# EAGLE design electrode_tester (EAGLE 9.1.3)
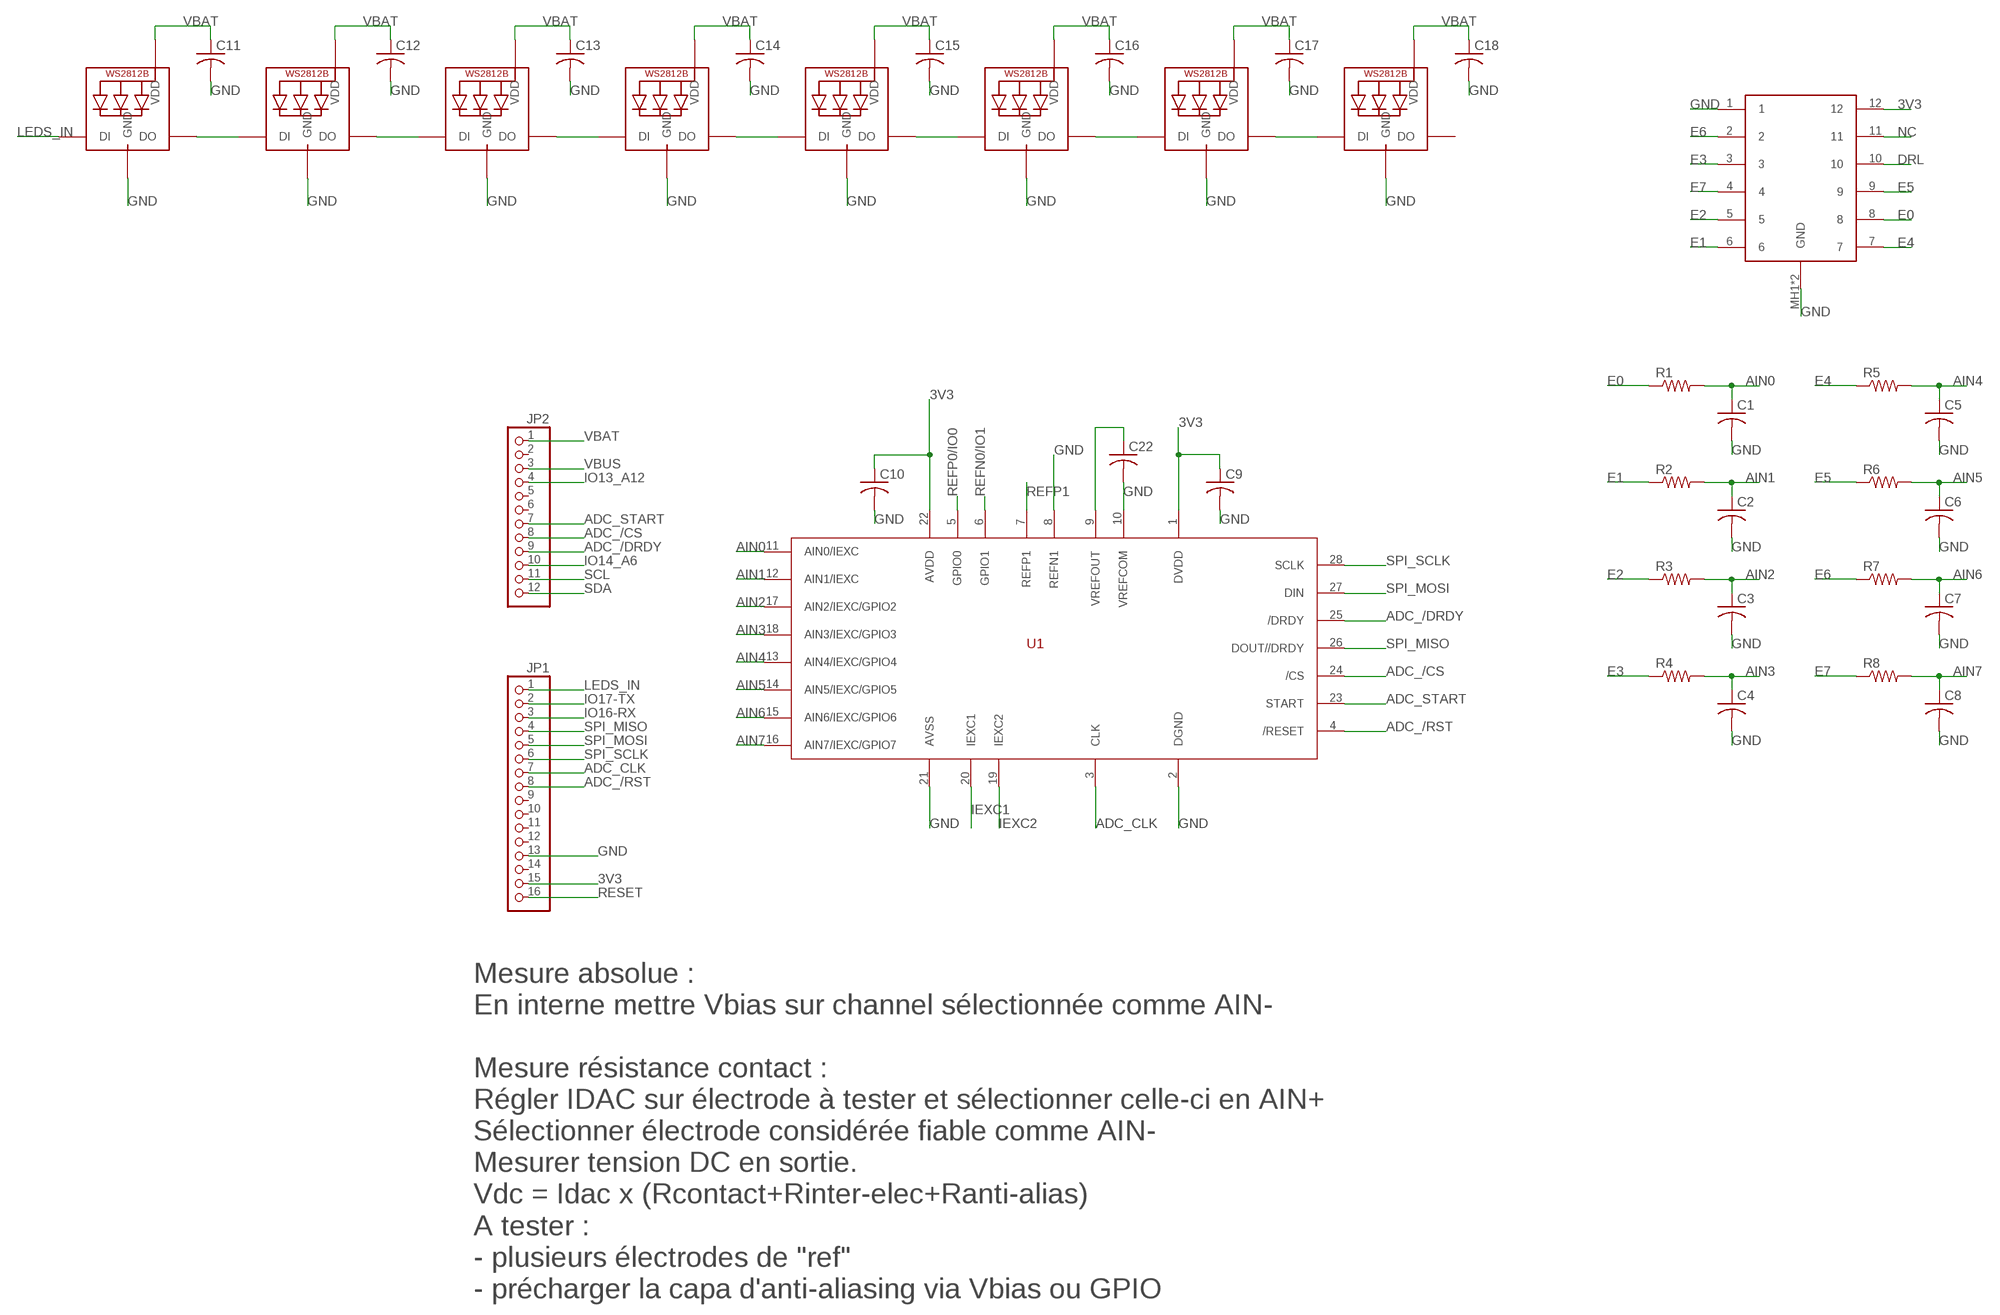
[diagram p0: schematic, sheet 1, part 1 of 2]
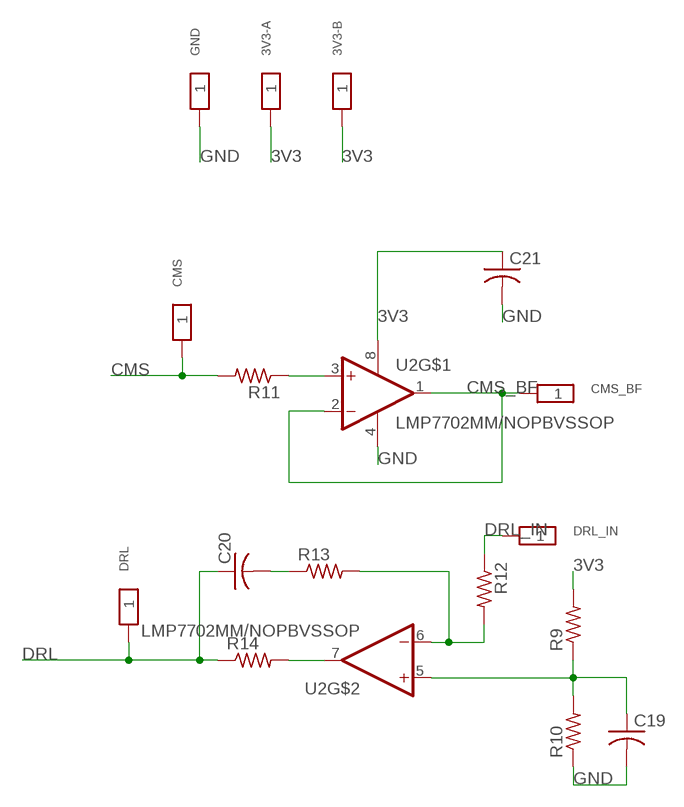
[diagram p1: schematic, sheet 1, part 2 of 2]

## Parts
3V3-A  TESTPAD_PROG  [TP1.5MM]
3V3-B  TESTPAD_PROG  [TP1.5MM]
C1  C-USC0603  [C0603]
C2  C-USC0603  [C0603]
C3  C-USC0603  [C0603]
C4  C-USC0603  [C0603]
C5  C-USC0603  [C0603]
C6  C-USC0603  [C0603]
C7  C-USC0603  [C0603]
C8  C-USC0603  [C0603]
C9  C-USC0603  [C0603]
C10  C-USC0603  [C0603]
C11  C-USC0603  [C0603]
C12  C-USC0603  [C0603]
C13  C-USC0603  [C0603]
C14  C-USC0603  [C0603]
C15  C-USC0603  [C0603]
C16  C-USC0603  [C0603]
C17  C-USC0603  [C0603]
C18  C-USC0603  [C0603]
C19  C-USC0603  [C0603]
C20  C-USC0603  [C0603]
C21  C-USC0603  [C0603]
C22  C-USC0603  [C0603]
CMS  TESTPAD_PROG  [TP1.5MM]
CMS_BF  TESTPAD_PROG  [TP1.5MM]
CONN1  505110-1292  [505110-1292]
DRL  TESTPAD_PROG  [TP1.5MM]
DRL_IN  TESTPAD_PROG  [TP1.5MM]
GND  TESTPAD_PROG  [TP1.5MM]
JP1  HEADER-1X16ROUND  [1X16_ROUND]
JP2  HEADER-1X12  [1X12_ROUND]
LED1  WS2812B5050  [WS2812B]
LED2  WS2812B5050  [WS2812B]
LED3  WS2812B5050  [WS2812B]
LED4  WS2812B5050  [WS2812B]
LED5  WS2812B5050  [WS2812B]
LED6  WS2812B5050  [WS2812B]
LED7  WS2812B5050  [WS2812B]
LED8  WS2812B5050  [WS2812B]
R1  R-US_R0603  [R0603]
R2  R-US_R0603  [R0603]
R3  R-US_R0603  [R0603]
R4  R-US_R0603  [R0603]
R5  R-US_R0603  [R0603]
R6  R-US_R0603  [R0603]
R7  R-US_R0603  [R0603]
R8  R-US_R0603  [R0603]
R9  R-US_R0603  [R0603]
R10  R-US_R0603  [R0603]
R11  R-US_R0603  [R0603]
R12  R-US_R0603  [R0603]
R13  R-US_R0603  [R0603]
R14  R-US_R0603  [R0603]
U1  ADS1248  [TSSOP28]
U2  LMP7702MM/NOPBVSSOP  [VSSOP8]

## Nets
3V3: 3V3-A.1 3V3-B.1 C9.1 C10.1 C21.1 CONN1.12 JP1.15 R9.2 U1.1(DVDD) U1.22(AVDD) U2.8(V+)
ADC_/CS: JP2.8 U1.24(/CS)
ADC_/DRDY: JP2.9 U1.25(/DRDY)
ADC_/RST: JP1.8 U1.4(/RESET)
ADC_CLK: JP1.7 U1.3(CLK)
ADC_START: JP2.7 U1.23(START)
AIN0: C1.1 R1.2 U1.11(AIN0/IEXC)
AIN1: C2.1 R2.2 U1.12(AIN1/IEXC)
AIN2: C3.1 R3.2 U1.17(AIN2/IEXC/GPIO2)
AIN3: C4.1 R4.2 U1.18(AIN3/IEXC/GPIO3)
AIN4: C5.1 R5.2 U1.13(AIN4/IEXC/GPIO4)
AIN5: C6.1 R6.2 U1.14(AIN5/IEXC/GPIO5)
AIN6: C7.1 R7.2 U1.15(AIN6/IEXC/GPIO6)
AIN7: C8.1 R8.2 U1.16(AIN7/IEXC/GPIO7)
CMS: CMS.1 R11.2
CMS_BF: CMS_BF.1 U2.1(OUT) U2.2(-IN)
DRL: C20.1 CONN1.10 DRL.1 R14.1
DRL_IN: DRL_IN.1 R12.1
E0: CONN1.8 R1.1
E1: CONN1.6 R2.1
E2: CONN1.5 R3.1
E3: CONN1.3 R4.1
E4: CONN1.7 R5.1
E5: CONN1.9 R6.1
E6: CONN1.2 R7.1
E7: CONN1.4 R8.1
GND: C1.2 C2.2 C3.2 C4.2 C5.2 C6.2 C7.2 C8.2 C9.2 C10.2 C11.2 C12.2 C13.2 C14.2 C15.2 C16.2 C17.2 C18.2 C19.2 C21.2 C22.2 CONN1.1 CONN1.MH1(GND) CONN1.MH2(GND) GND.1 JP1.13 LED1.3-GND(GND) LED2.3-GND(GND) LED3.3-GND(GND) LED4.3-GND(GND) LED5.3-GND(GND) LED6.3-GND(GND) LED7.3-GND(GND) LED8.3-GND(GND) R10.1 U1.2(DGND) U1.8(REFN1) U1.10(VREFCOM) U1.21(AVSS) U2.4(V-)
IEXC1: U1.20(IEXC1)
IEXC2: U1.19(IEXC2)
IO13_A12: JP2.4
IO14_A6: JP2.10
IO16-RX: JP1.3
IO17-TX: JP1.2
LEDS_IN: JP1.1 LED1.4-DIN(DI)
N$1: LED1.2-DOUT(DO) LED2.4-DIN(DI)
N$2: LED2.2-DOUT(DO) LED3.4-DIN(DI)
N$3: LED3.2-DOUT(DO) LED4.4-DIN(DI)
N$4: LED4.2-DOUT(DO) LED5.4-DIN(DI)
N$5: LED5.2-DOUT(DO) LED6.4-DIN(DI)
N$6: LED6.2-DOUT(DO) LED7.4-DIN(DI)
N$7: LED7.2-DOUT(DO) LED8.4-DIN(DI)
N$8: R11.1 U2.3(+IN)
N$9: C22.1 U1.9(VREFOUT)
N$12: R12.2 R13.2 U2.6(-IN)
N$14: C20.2 R13.1
N$15: R14.2 U2.7(OUT)
N$16: C19.1 R9.1 R10.2 U2.5(+IN)
NC: CONN1.11
REFN0/IO1: U1.6(GPIO1)
REFP0/IO0: U1.5(GPIO0)
REFP1: U1.7(REFP1)
RESET: JP1.16
SCL: JP2.11
SDA: JP2.12
SPI_MISO: JP1.4 U1.26(DOUT//DRDY)
SPI_MOSI: JP1.5 U1.27(DIN)
SPI_SCLK: JP1.6 U1.28(SCLK)
VBAT: C11.1 C12.1 C13.1 C14.1 C15.1 C16.1 C17.1 C18.1 JP2.1 LED1.1-VDD(VDD) LED2.1-VDD(VDD) LED3.1-VDD(VDD) LED4.1-VDD(VDD) LED5.1-VDD(VDD) LED6.1-VDD(VDD) LED7.1-VDD(VDD) LED8.1-VDD(VDD)
VBUS: JP2.3
Unconnected: JP1.9 JP1.10 JP1.11 JP1.12 JP1.14 JP2.2 JP2.5 JP2.6 LED8.2-DOUT(DO)

## Notes on the sheet
- Mesure absolue :
  En interne mettre Vbias sur channel sélectionnée comme AIN-
  
  Mesure résistance contact :
  Régler IDAC sur électrode à tester et sélectionner celle-ci en AIN+
  Sélectionner électrode considérée fiable comme AIN-
  Mesurer tension DC en sortie.
  Vdc = Idac x (Rcontact+Rinter-elec+Ranti-alias)
  A tester : 
  - plusieurs électrodes de "ref"
  - précharger la capa d'anti-aliasing via Vbias ou GPIO

## Library data of the parts
3V3-A 3V3-B CMS CMS_BF DRL DRL_IN GND = electrode_tester:TESTPAD_PROG: TESTPAD
C1-C22 = electrode_tester:C-US: CAPACITOR, American symbol; SPICEPREFIX: C
CONN1 = electrode_tester:505110-1292
JP1 = electrode_tester:HEADER-1X16: PIN HEADER
JP2 = electrode_tester:HEADER-1X12
LED1-LED8 = electrode_tester:WS2812B
R1-R14 = electrode_tester:R-US_: RESISTOR, American symbol; SPICEPREFIX: R
U1 = electrode_tester:ADS1248
U2 = electrode_tester:LMP7702MM/NOPB: Op Amps Prec RRIO 12V Dual Op Amp; DESCRIPTION: Op Amps Prec RRIO 12V Dual Op Amp; MF: Texas Instruments; MP: LMP7702MM/NOPB; PACKAGE: MSOP-8

## Board
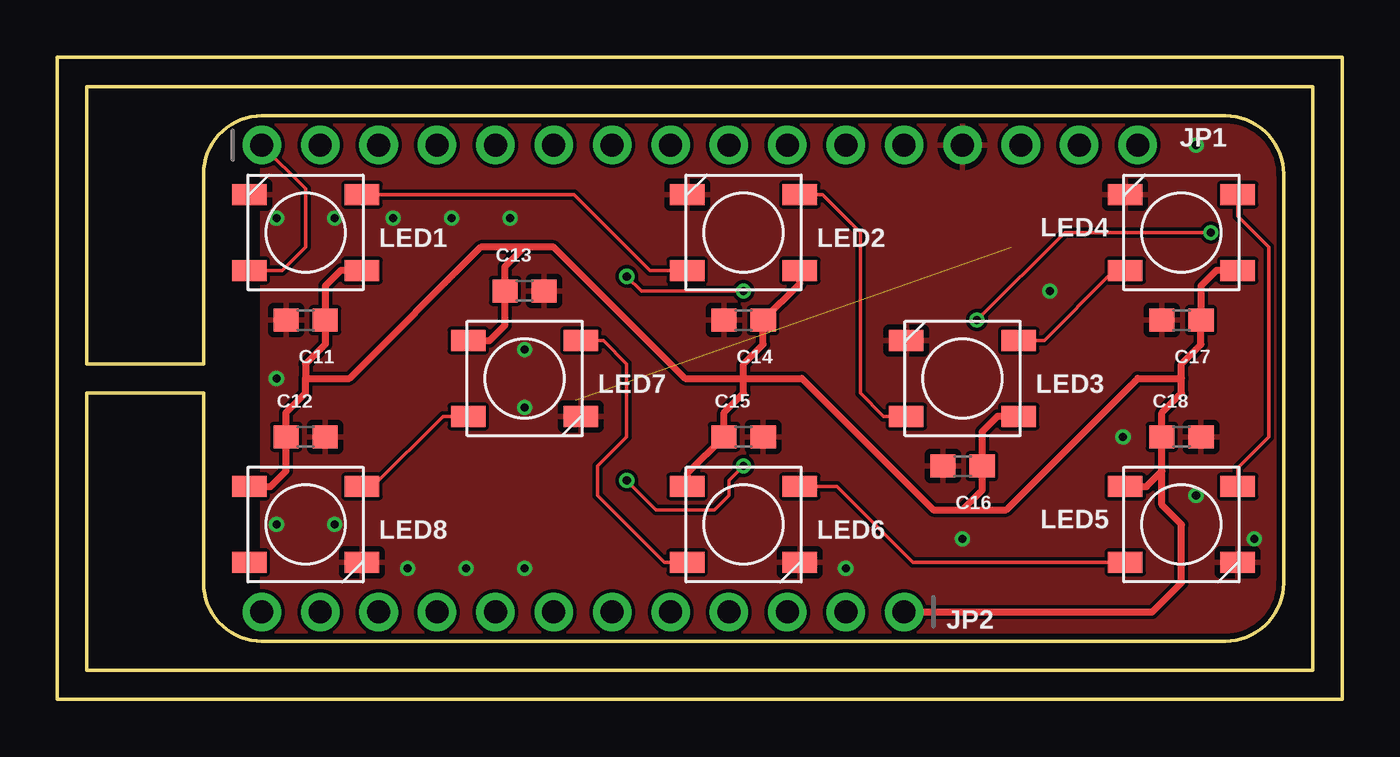
[diagram p2: board, top side]
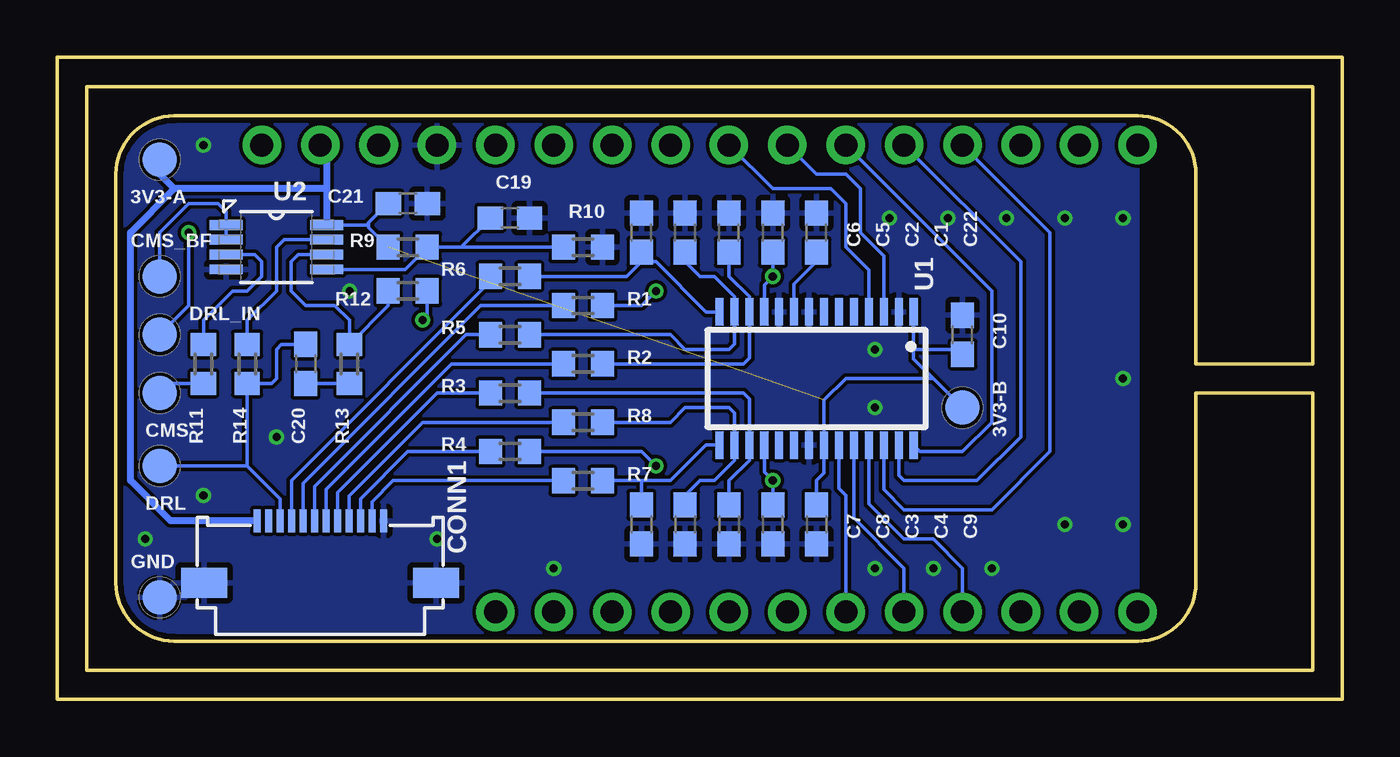
[diagram p3: board, bottom side, seen from below]

Size 55.88 x 27.94 mm. Coordinates in mm from the lower left corner, seen from the top.
Outline: 8.89,2.54 arc-90 6.35,5.08 6.35,13.34 1.27,13.34 1.27,1.27 54.61,1.27 54.61,26.67 1.27,26.67 1.27,14.61 6.35,14.61 6.35,22.86 arc-90 8.89,25.4 50.8,25.4 arc-90 53.34,22.86 53.34,5.08 arc-90 50.8,2.54 8.89,2.54
Outline: 0,27.94 0,0 55.88,0 55.88,27.94 0,27.94
Copper layers (1*16): Top 0.035mm / dielectric 1.5mm / Bottom 0.035mm
Design rules "SeeedStudio_2layer_DRU_no_angle_20140221": minimum track width 6mil, minimum drill 12mil, track to track 6mil, track to pad 6mil, pad to pad 6mil, via to via 6mil, smd to smd 0mil, copper to edge 10mil, drill to drill 10mil, minimum pad ring 10mil, minimum via ring 6mil, stop-mask expansion 2mil, vias tented up to drill 100mil, thermal gap 10mil

### Footprints (pad centres in the part's own frame; a part is rotated, then mirrored left to right if it is on the bottom)
TP1.5MM = smd 1.5 x 1.5: 1 0,0
C0603 = smd 1.1 x 1: 1 -0.85,0; 2 0.85,0
505110-1292 = smd 0.3 x 1: 1 -2.75,-2.7; 2 -2.25,-2.7; 3 -1.75,-2.7; 4 -1.25,-2.7; 5 -0.75,-2.7; 6 -0.25,-2.7; 7 0.25,-2.7; 8 0.75,-2.7; 9 1.25,-2.7; 10 1.75,-2.7; 11 2.25,-2.7; 12 2.75,-2.7 | smd 2 x 1.3: MH1 -5.05,0; MH2 5.05,0
1X16_ROUND = drill 1 pad 1.676: 1 -19.05,0; 2 -16.51,0; 3 -13.97,0; 4 -11.43,0; 5 -8.89,0; 6 -6.35,0; 7 -3.81,0; 8 -1.27,0; 9 1.27,0; 10 3.81,0; 11 6.35,0; 12 8.89,0; 13 11.43,0; 14 13.97,0; 15 16.51,0; 16 19.05,0
1X12_ROUND = drill 1 pad 1.676: 1 -13.97,0; 2 -11.43,0; 3 -8.89,0; 4 -6.35,0; 5 -3.81,0; 6 -1.27,0; 7 1.27,0; 8 3.81,0; 9 6.35,0; 10 8.89,0; 11 11.43,0; 12 13.97,0
WS2812B = smd 1.5 x 0.9: 1-VDD 2.45,-1.65; 2-DOUT 2.45,1.65; 3-GND -2.45,1.65; 4-DIN -2.45,-1.65
R0603 = smd 1 x 1.1: 1 -0.85,0; 2 0.85,0
TSSOP28 = smd 0.35 x 1.2: 1 -4.225,-2.9; 2 -3.575,-2.9; 3 -2.925,-2.9; 4 -2.275,-2.9; 5 -1.625,-2.9; 6 -0.975,-2.9; 7 -0.325,-2.9; 8 0.325,-2.9; 9 0.975,-2.9; 10 1.625,-2.9; 11 2.275,-2.9; 12 2.925,-2.9; 13 3.575,-2.9; 14 4.225,-2.9; 15 4.225,2.9; 16 3.575,2.9; 17 2.925,2.9; 18 2.275,2.9; 19 1.625,2.9; 20 0.975,2.9; 21 0.325,2.9; 22 -0.325,2.9; 23 -0.975,2.9; 24 -1.625,2.9; 25 -2.275,2.9; 26 -2.925,2.9; 27 -3.575,2.9; 28 -4.225,2.9
VSSOP8 = smd 1.422 x 0.432: 1 -2.184,0.965; 2 -2.184,0.33; 3 -2.184,-0.33; 4 -2.184,-0.965; 5 2.184,-0.965; 6 2.184,-0.33; 7 2.184,0.33; 8 2.184,0.965

### Placement (x,y rotation side)
3V3-A  51.44,23.49 0 bottom
3V3-B  16.51,12.7 0 bottom
C1  24.77,20.32 90 bottom
C2  26.67,20.32 90 bottom
C3  26.67,7.62 270 bottom
C4  24.77,7.62 270 bottom
C5  28.57,20.32 90 bottom
C6  30.48,20.32 90 bottom
C7  30.48,7.62 270 bottom
C8  28.57,7.62 270 bottom
C9  22.86,7.62 270 bottom
C10  16.51,15.88 90 bottom
C11  10.8,16.51 180 top
C12  10.8,11.43 0 top
C13  20.32,17.78 0 top
C14  29.84,16.51 180 top
C15  29.84,11.43 0 top
C16  39.37,10.16 180 top
C17  48.89,16.51 180 top
C18  48.89,11.43 0 top
C19  36.2,20.95 0 bottom
C20  45.09,14.61 270 bottom
C21  40.64,21.59 0 bottom
C22  22.86,20.32 90 bottom
CMS  51.44,13.34 0 bottom
CMS_BF  51.44,18.41 0 bottom
CONN1  44.45,5.08 180 bottom
DRL  51.44,10.16 0 bottom
DRL_IN  51.44,15.88 0 bottom
GND  51.44,4.45 0 bottom
JP1  27.94,24.13 0 top
JP2  22.86,3.81 180 top
LED1  10.8,20.32 0 top
LED2  29.84,20.32 0 top
LED3  39.37,13.97 0 top
LED4  48.89,20.32 0 top
LED5  48.89,7.62 180 top
LED6  29.84,7.62 180 top
LED7  20.32,13.97 180 top
LED8  10.8,7.62 180 top
R1  33.02,17.14 0 bottom
R2  33.02,14.61 0 bottom
R3  36.2,13.34 0 bottom
R4  36.2,10.8 0 bottom
R5  36.2,15.88 0 bottom
R6  36.2,18.41 0 bottom
R7  33.02,9.53 0 bottom
R8  33.02,12.07 0 bottom
R9  40.64,19.68 180 bottom
R10  33.02,19.68 180 bottom
R11  49.53,14.61 270 bottom
R12  40.64,17.78 180 bottom
R13  43.18,14.61 90 bottom
R14  47.62,14.61 90 bottom
U1  22.86,13.97 180 bottom
U2  46.35,19.68 0 bottom

### Tracks (layer width: path | path; a pad name or v marks a point on that pad's centre or on a via)
3V3  (1 unrouted)
  Bottom 0.152: 42.43,20.65 U2.8 42.43,20.65 | 42.43,20.65 42.34,20.74 | 42.34,20.74 C21.1 | 42.34,20.74 42.34,20.53 R9.2 | U1.1 18.63,15.24 | 18.63,15.24 18.63,14.82 17.78,13.97 | 17.78,13.97 21.59,13.97 22.54,13.02 U1.22 22.54,9.85 22.86,9.53 C9.1 | 17.78,13.97 3V3-B.1 | C10.1 16.73,15.24 18.63,15.24
  Bottom 0.305: CONN1.12 50.96,7.78 52.7,9.53 52.7,20.32 | 52.7,20.32 50.8,22.22 | 44.17,22.22 50.8,22.22 | 44.17,23.85 JP1.15 44.17,23.85 | 44.17,23.85 44.17,22.22 | 44.17,22.22 U2.8 | 50.8,22.22 51.44,22.86 | 51.44,22.86 3V3-A.1 | 44.17,22.22 50.8,22.22 | 44.17,22.22 U2.8 | 44.17,23.85 44.17,22.22 | 44.17,23.85 44.17,22.22 | 52.7,20.32 50.8,22.22 | 50.8,22.22 51.44,22.86 | 44.17,22.22 U2.8 | 44.17,22.22 50.8,22.22 | 44.17,22.22 50.8,22.22 | 44.17,23.85 44.17,22.22
ADC_/CS
  Bottom 0.152: U1.24 21.23,7.9 19.05,5.71 JP2.8
ADC_/DRDY
  Bottom 0.152: U1.25 20.59,8.52 19.05,6.99 17.78,6.99 16.51,5.71 JP2.9
ADC_/RST
  Bottom 0.152: U1.4 20.59,18.68 21.59,19.68 21.59,21.59 22.22,22.22 24.77,22.22 JP1.8
ADC_CLK
  Bottom 0.152: U1.3 19.93,19.3 20.95,20.32 20.95,22.22 21.59,22.86 22.86,22.86 JP1.7
ADC_START
  Bottom 0.152: U1.23 21.88,9.18 21.59,8.89 JP2.7
AIN0  (via drill 0.35)
  Top 0.152: v24.77,18.41 25.4,17.78 v29.84,17.78
  Bottom 0.152: U1.11 25.13,18.05 v24.77,18.41 C1.1 | v29.84,17.78 30.48,17.14 R1.2
AIN1
  Bottom 0.152: R2.2 26.04,14.61 25.79,14.86 U1.12 25.79,17.53 26.67,18.41 C2.1
AIN2
  Bottom 0.152: R3.2 26.04,13.34 25.79,13.09 U1.17 25.79,10.41 26.67,9.53 C3.1
AIN3  (via drill 0.35)
  Top 0.152: v24.77,9.53 26.04,8.25 27.3,8.25 28.57,8.25 29.21,8.89 29.21,9.53 v29.84,10.16
  Bottom 0.152: U1.18 25.13,9.89 v24.77,9.53 C4.1 | v29.84,10.16 30.48,10.8 R4.2
AIN4
  Bottom 0.152: R5.2 29.21,15.88 28.57,15.24 26.67,15.24 26.43,15.48 U1.13 26.43,17.55 27.3,18.41 27.94,18.41 28.57,19.05 C5.1
AIN5
  Bottom 0.152: R6.2 31.11,18.41 30.48,19.05 C6.1 30.06,19.05 29.84,19.05 27.66,16.87 U1.14
AIN6
  Bottom 0.152: R7.2 30.48,9.53 | 30.48,9.53 29.21,9.53 27.66,11.07 U1.15 | C7.1 30.48,9.53
AIN7
  Bottom 0.152: R8.2 29.21,12.07 28.57,12.7 26.67,12.7 26.43,12.46 U1.16 26.43,10.39 27.3,9.53 27.94,9.53 28.57,8.89 C8.1
CMS
  Bottom 0.152: R11.2 51.02,13.75 CMS.1
CMS_BF
  Bottom 0.152: U2.2 U2.1 48.54,21.23 48.89,21.59 50.16,21.59 51.44,20.32 CMS_BF.1
DRL
  Bottom 0.152: CONN1.10 46.2,8.73 47.62,10.16 | DRL.1 47.62,10.16 | 47.62,10.16 R14.1 46.57,13.75 46.35,13.97 46.35,15.24 46.14,15.45 C20.1
DRL_IN  (via drill 0.35)
  Top 0.152: v50.16,20.32 43.81,20.32 v40.01,16.51
  Bottom 0.152: v40.01,16.51 39.79,16.73 R12.1 | DRL_IN.1 50.16,17.14 v50.16,20.32
E0
  Bottom 0.152: R1.1 37.46,17.14 45.2,9.41 CONN1.8
E1
  Bottom 0.152: CONN1.6 44.2,9.14 38.73,14.61 R2.1
E2
  Bottom 0.152: CONN1.5 43.7,9 39.37,13.34 R3.1
E3
  Bottom 0.152: CONN1.3 42.7,8.73 40.64,10.8 R4.1
E4
  Bottom 0.152: R5.1 38.1,15.88 44.7,9.28 CONN1.7
E5
  Bottom 0.152: R6.1 37.05,18 37.25,18 45.7,9.54 CONN1.9
E6
  Bottom 0.152: CONN1.2 42.2,8.6 41.27,9.53 R7.1
E7
  Bottom 0.152: CONN1.4 43.2,8.87 40.01,12.07 R8.1
GND  (via drill 0.35)
  other vias: 20.32,12.7 20.32,15.24 20.32,5.71 17.78,5.71 17.14,20.95 14.61,20.95 15.24,5.71 9.53,20.95 9.53,13.97 12.07,20.95 49.53,24.13 43.18,17.78 46.35,11.43 49.53,8.89 19.68,20.95 9.53,7.62 12.07,7.62 39.37,6.99 34.29,5.71 52.07,6.99
  pour Bottom: 53.98,26.04 8.89,26.04 8.89,1.91 53.98,1.91
  pour Top: 53.98,26.04 53.98,1.91 8.89,1.91 8.89,26.04
LEDS_IN
  Top 0.152: JP1.1 10.8,22.22 10.8,19.68 9.78,18.67 LED1.4-DIN
N$1
  Top 0.152: LED1.2-DOUT 22.48,21.97 25.78,18.67 LED2.4-DIN
N$2
  Top 0.152: LED2.2-DOUT 33.27,21.97 34.92,20.32 34.92,13.34 35.94,12.32 LED3.4-DIN
N$3
  Top 0.152: LED4.4-DIN 46.45,18.5 45.81,18.5 42.92,15.62 LED3.2-DOUT
N$4
  Top 0.152: LED4.2-DOUT 51.34,21.04 52.7,19.68 52.7,11.43 51.34,10.07 LED5.4-DIN
N$5
  Top 0.152: LED5.2-DOUT 37.21,5.97 33.91,9.27 LED6.4-DIN
N$6
  Top 0.152: LED6.2-DOUT 26.41,5.97 23.49,8.89 23.49,10.16 24.77,11.43 24.77,14.61 23.75,15.62 LED7.4-DIN
N$7
  Top 0.152: LED7.2-DOUT 16.77,12.32 13.71,9.27 LED8.4-DIN
N$8
  Bottom 0.152: U2.3 47.3,19.36 46.99,19.05 46.99,18.41 47.62,17.78 48.26,17.78 49.53,16.51 R11.1
N$9
  Bottom 0.152: U1.9 23.84,18.07 22.86,19.05 C22.1
N$12
  Bottom 0.152: R12.2 41.49,17.14 R13.2 43.18,16.51 43.81,17.14 45.09,17.14 45.72,17.78 45.72,19.05 45.41,19.36 U2.6
N$14
  Bottom 0.152: C20.2 R13.1
N$15
  Bottom 0.152: U2.7 46.02,20.02 46.35,19.68 46.35,17.78 47.62,16.51 R14.2
N$16
  Bottom 0.152: 38.31,19.68 R9.1 40.76,18.72 U2.5 | 38.31,19.68 R10.2 | C19.1 38.31,19.68
SPI_MISO
  Bottom 0.152: U1.26 19.93,9.14 19.05,8.25 15.24,8.25 12.7,10.8 12.7,20.32 JP1.4
SPI_MOSI
  Bottom 0.152: U1.27 19.29,9.76 19.05,9.53 15.88,9.53 13.97,11.43 13.97,19.05 JP1.5
SPI_SCLK
  Bottom 0.152: U1.28 18.36,10.8 16.51,10.8 15.24,12.07 15.24,17.78 17.14,19.68 JP1.6
VBAT
  Top 0.305: 29.84,13.97 27.3,13.97 21.59,19.68 20.32,19.68 | 29.84,13.97 32.38,13.97 38.1,8.25 39.37,8.25 | 39.37,8.25 41.27,8.25 46.99,13.97 48.89,13.97 | 20.32,19.68 18.41,19.68 12.7,13.97 10.8,13.97 | 10.8,13.97 10.8,14.61 11.64,15.45 C11.1 11.64,18 12.32,18.67 LED1.1-VDD | 10.8,13.97 10.8,13.34 9.95,12.48 C12.1 9.95,9.95 9.27,9.27 LED8.1-VDD | 29.84,13.97 29.84,14.61 30.7,15.45 C14.1 32.3,18.11 LED2.1-VDD | 29.84,13.97 29.84,13.34 28.99,12.48 C15.1 27.39,9.83 LED6.1-VDD | 48.89,13.97 48.89,14.61 49.74,15.45 C17.1 49.74,18 50.42,18.67 LED4.1-VDD | 48.89,13.97 48.89,13.34 48.05,12.48 C18.1 48.05,9.95 | 20.32,19.68 19.47,18.84 C13.1 19.47,16.3 18.79,15.62 LED7.1-VDD | 39.37,8.25 40.22,9.11 C16.1 40.22,11.64 40.89,12.32 LED3.1-VDD | LED5.1-VDD 47.37,9.27 48.05,9.95 | JP2.1 47.62,3.81 48.89,5.08 48.89,7.62 48.05,8.47 48.05,9.95